# Altium schematic sheet 22-eDP.SchDoc
size A3
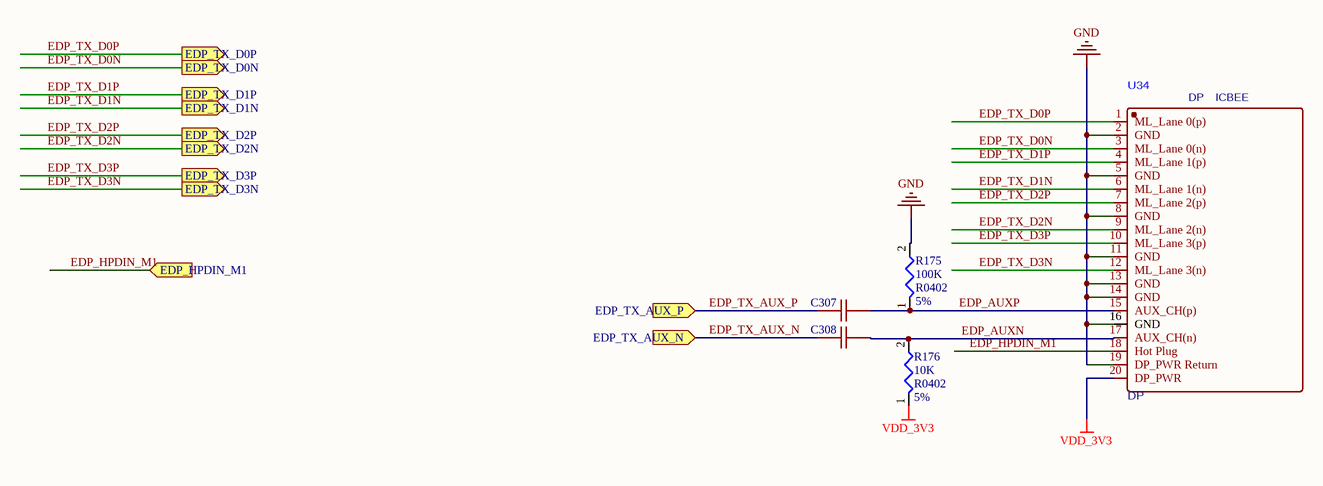
[diagram p0: 22-eDP.SchDoc]

## Parts
C307  100nF  [C0201]  (value not drawn)
C308  100nF  [C0201]  (value not drawn)
R175  100K  Tolerance: 5%  [R0402]
R176  10K  Tolerance: 5%  [R0402]
U34  DP  [DP-ICBEE]

## Ports
EDP_HPDIN_M1 (in), EDP_TX_AUX_N (in), EDP_TX_AUX_P (in), EDP_TX_D0N (out), EDP_TX_D0P (out), EDP_TX_D1N (out), EDP_TX_D1P (out), EDP_TX_D2N (out), EDP_TX_D2P (out), EDP_TX_D3N (out), EDP_TX_D3P (out)

## Nets
GND: R175.2 U34.2(GND) U34.5(GND) U34.8(GND) U34.11(GND) U34.13(GND) U34.14(GND) U34.16(GND) U34.19(DP_PWR_Return)
VDD_3V3: R176.1 U34.20(DP_PWR)
EDP_AUXN: C308.2 R176.2 U34.17(AUX_CH(n))
EDP_AUXP: C307.2 R175.1 U34.15(AUX_CH(p))
EDP_HPDIN_M1: U34.18(Hot_Plug) ; port EDP_HPDIN_M1
EDP_TX_AUX_N: C308.1 ; port EDP_TX_AUX_N
EDP_TX_AUX_P: C307.1 ; port EDP_TX_AUX_P
EDP_TX_D0N: U34.3(ML_Lane_0(n)) ; port EDP_TX_D0N
EDP_TX_D0P: U34.1(ML_Lane_0(p)) ; port EDP_TX_D0P
EDP_TX_D1N: U34.6(ML_Lane_1(n)) ; port EDP_TX_D1N
EDP_TX_D1P: U34.4(ML_Lane_1(p)) ; port EDP_TX_D1P
EDP_TX_D2N: U34.9(ML_Lane_2(n)) ; port EDP_TX_D2N
EDP_TX_D2P: U34.7(ML_Lane_2(p)) ; port EDP_TX_D2P
EDP_TX_D3N: U34.12(ML_Lane_3(n)) ; port EDP_TX_D3N
EDP_TX_D3P: U34.10(ML_Lane_3(p)) ; port EDP_TX_D3P

## Notes on the sheet
- (in symbol DP) ICBEE

## Library data of the parts
C307 C308 = CL03A104KO3NNNC: 容值:100nF;精度:±10%;额定电压:16V;材质(温度系数):X5R;; Manufacturer: SAMSUNG(三星); Add into BOM: yes; Tolerance: ±10%; Voltage Rated: 16V; Temperature Coefficient: X5R; Symbol: CL03A104KO3NNNC; Device: CL03A104KO3NNNC; LCSC Part Name: 100nF ±10% 16V; Supplier Part: C307380; Manufacturer Part: CL03A104KO3NNNC; Supplier Footprint: 0201; JLCPCB Part Class: 扩展库; Datasheet: https://atta.szlcsc.com/upload/public/pdf/source/20160218/1457707763339.pdf; Supplier: LCSC; Convert to PCB: yes; Value: 100nF
R175 R176 = RESISTOR_Dup1: 通用厚膜电阻,10K,+/-5%,R0402,1/16W.; Manufacturer PN: RC0402JR-0710KL; Manufacturer: YAGEO; Wattage: 1/16W; Priority: A; PCB Footprint: R0402; Created by: YTL; Part Type: 通用厚膜电阻; RK PN: RC0402JR-0710KL